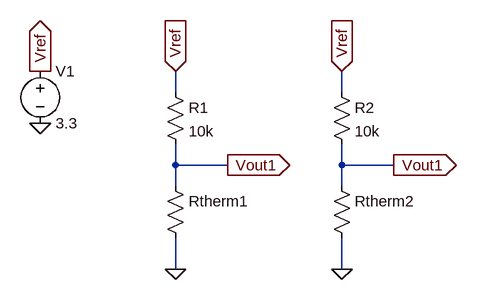
[diagram p0: schematic double_thermistor_diagram.asc]
double_thermistor_diagram.asc, the LTspice schematic file:
Version 4.1
SHEET 1 1056 680
WIRE 320 48 320 16
WIRE 576 48 576 16
WIRE 320 160 320 128
WIRE 400 160 320 160
WIRE 576 160 576 128
WIRE 656 160 576 160
WIRE 320 192 320 160
WIRE 576 192 576 160
WIRE 320 320 320 272
WIRE 576 320 576 272
FLAG 112 96 0
FLAG 112 16 Vref
IOPIN 112 16 Out
FLAG 320 16 Vref
IOPIN 320 16 In
FLAG 320 320 0
FLAG 400 160 Vout1
IOPIN 400 160 Out
FLAG 576 16 Vref
IOPIN 576 16 In
FLAG 576 320 0
FLAG 656 160 Vout1
IOPIN 656 160 Out
SYMBOL voltage 112 0 R0
WINDOW 123 0 0 Left 0
WINDOW 39 0 0 Left 0
SYMATTR InstName V1
SYMATTR Value 3.3
SYMBOL res 304 32 R0
SYMATTR InstName R1
SYMATTR Value 10k
SYMBOL res 304 176 R0
SYMATTR InstName Rtherm1
SYMATTR Value ""
SYMBOL res 560 32 R0
SYMATTR InstName R2
SYMATTR Value 10k
SYMBOL res 560 176 R0
SYMATTR InstName Rtherm2
SYMATTR Value ""

The netlist it stands for:
* double_thermistor_diagram.asc
V1 Vref 0 3.3
R1 Vref Vout1 10k
Rtherm1 Vout1 0
R2 Vref Vout1 10k
Rtherm2 Vout1 0
.backanno
.end